# EasyEDA Pro project ProPrj_初级项目_2026-01-11.epro, board PCB1_1
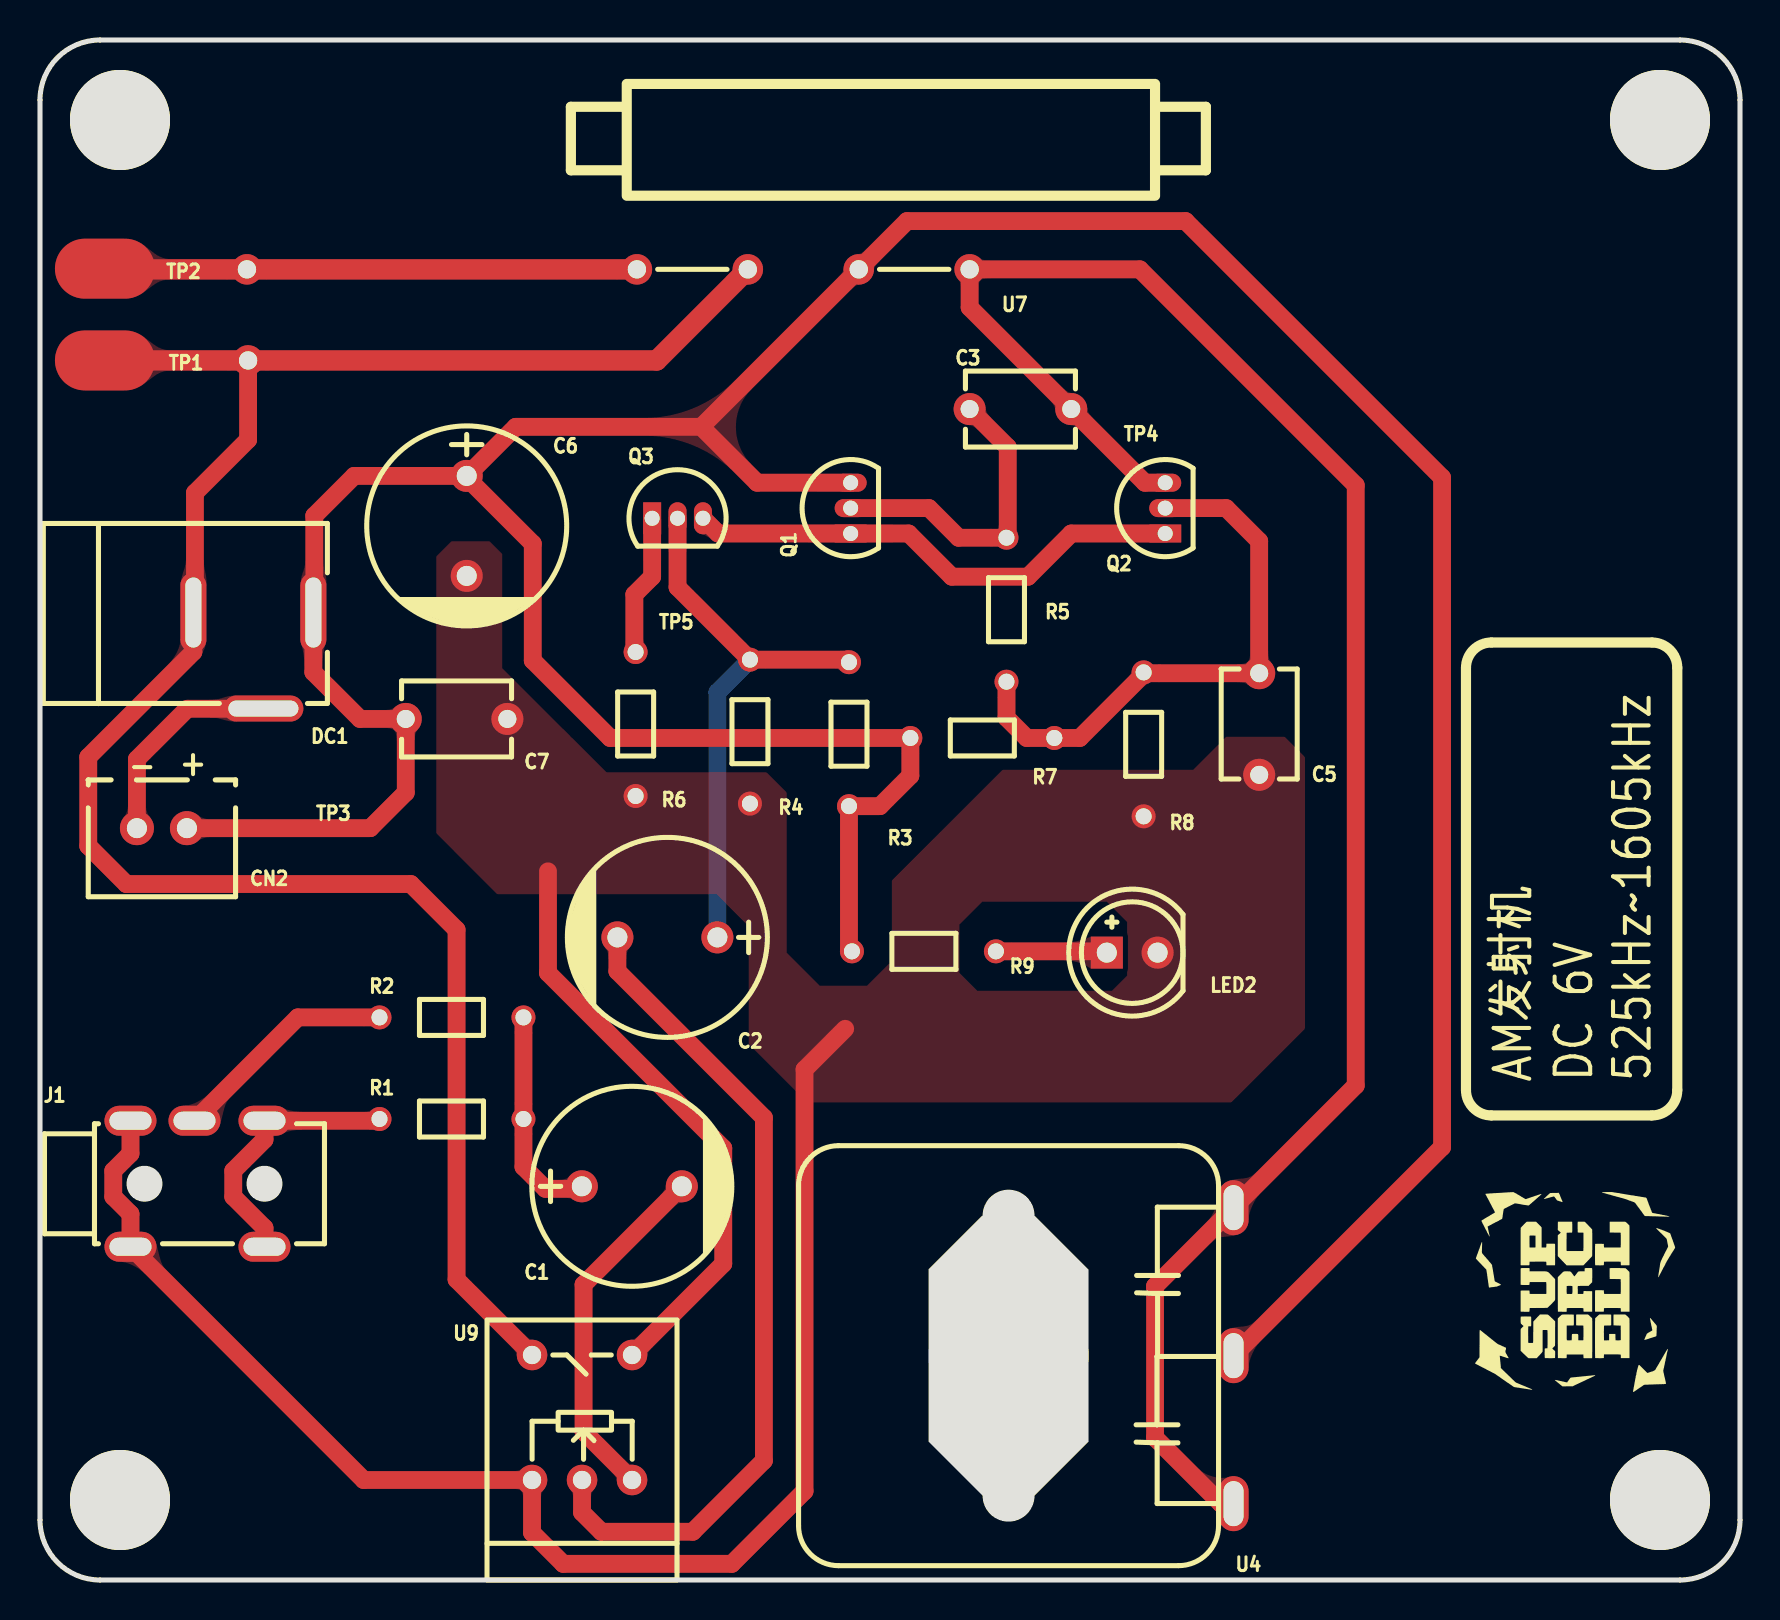
[diagram p4: board, top side]
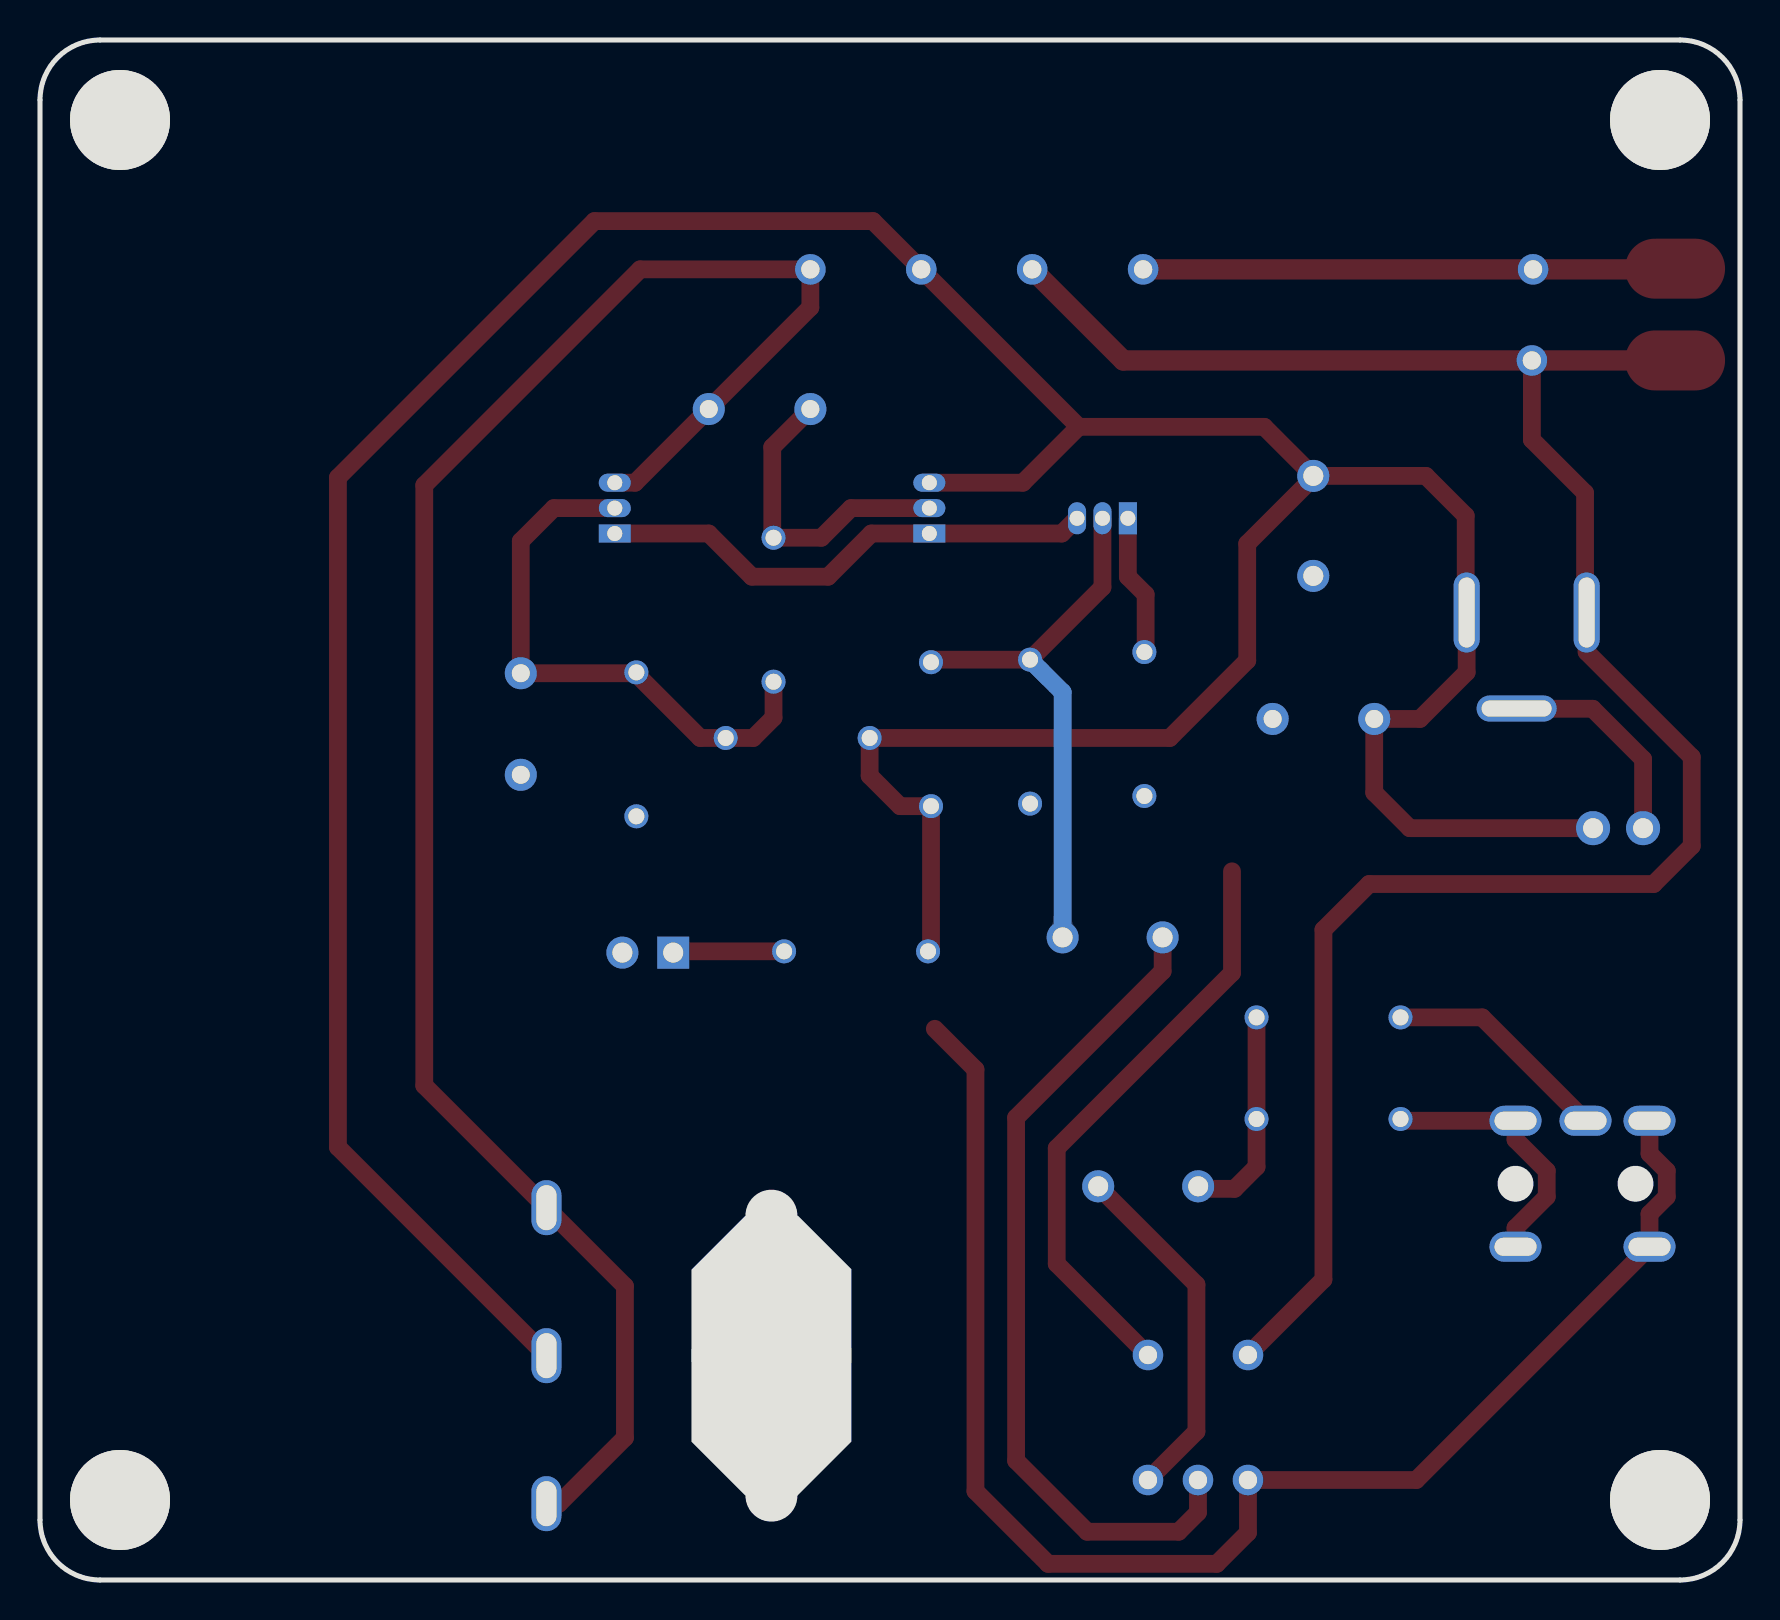
[diagram p5: board, bottom side, seen from below]

Outline 85 x 77 mm; copper layers: Top Layer, Bottom Layer. Coordinates in mm from the lower left corner of the outline.
Outline path: 0,74 0,3 arc(0.88,0.88) 3,0 82,0 arc(84.12,0.88) 85,3 85,74 arc(84.12,76.12) 82,77 3,77 arc(0.88,76.12) 0,74
Stack: Top Layer 0.035mm / Dielectric1 1.51mm FR4 er 4.5 / Bottom Layer 0.035mm

## Design rules (mm)
template: 自定义配置
spacing copperThickness1oz (default): track to track 0.102, other pairs 0 to 0.3
spacing copperThickness2oz: track to track 0.203, other pairs 0.152 to 0.3
track width copperThickness1oz: min 0.127, default 0.254, max 2.54
track width copperThickness2oz (default): min 0.203, default 0.889, max 2.54
differential pair differentialPair (default): width min 0.127, default 0.254, max 2.54; gap min 0.152, default 0.152
via viaSize (default): diameter min 0.5, default 0.61, max 10; hole min 0.3, default 0.305, max 6.299

## Placement (name value [footprint] x y rotation side)
C1  10u  [CAP-TH_BD10.0-P5.00-D0.6-FD]  29.59 19.69 0 top
C2  10u  [CAP-TH_BD10.0-P5.00-D0.6-FD]  31.37 32.13 180 top
C3  100uF  [CAP-TH_L5.5-W3.8-P5.08-D0.5]  49.02 58.55 0 top
C5  0.1uF  [CAP-TH_L5.5-W3.8-P5.08-D0.5]  60.96 42.8 90 top
C6  100u  [CAP-TH_BD10.0-P5.00-D0.6-FD]  21.34 52.7 270 top
C7  0.022uF  [CAP-TH_L5.5-W3.8-P5.08-D0.5]  20.83 43.05 180 top
CN2  B2B-XH-A(LF)(SN)  [CONN-TH_B2B-XH-A-LF-SN]  6.1 37.59 180 top
DC1  -  [DC-2.0]  10.54 48.64 180 top
J1  313耳机座直插  [AUDIO-TH_PJ313D]  7.87 19.81 0 top
LED2  -  [LED-TH_5mm]  54.61 31.37 0 top
NOREF  -  [Pad_e899]  10.41 60.98 0 top
NOREF#2  -  [Pad_e893]  10.35 65.53 0 top
Q1  S9018H331  [TO-92-3_L4.8-W3.7-P1.27-L-1]  40.53 53.59 90 top
Q2  S9018H331  [TO-92-3_L4.8-W3.7-P1.27-L-1]  56.26 53.59 90 top
Q3  S9018H331  [TO-92-3_L4.8-W3.7-P1.27-L-1]  31.88 53.09 0 top
R1  1kΩ  [Res_1/8W]  20.57 22.99 0 top
R2  1kΩ  [Res_1/8W]  20.57 28.07 0 top
R3  51kΩ  [Res_1/8W]  40.39 42.29 270 top
R4  8.2kΩ  [Res_1/8W]  35.56 42.42 90 top
R5  100kΩ  [Res_1/8W]  48.39 48.51 90 top
R6  3.3kΩ  [Res_1/8W]  29.84 42.8 90 top
R7  43kΩ  [Res_1/8W]  47.12 42.16 180 top
R8  15kΩ  [Res_1/8W]  55.25 41.78 90 top
R9  8.2kΩ  [Res_1/8W]  44.2 31.5 180 top
TP1  -  [Test-Point-0.5mm]  3.25 60.98 0 top
TP2  -  [Test-Point-0.5mm]  3.25 65.57 0 top
TP3  -  [Test-Point-0.5mm#2]  13.97 37.55 0 top
TP4  -  [Test-Point-0.5mm#2]  53.57 56.61 0 top
TP5  -  [Test-Point-0.5mm#2]  29.71 48.12 0 top
U4  -  [可变电容]  58.93 21.72 180 top
U7  -  [天线变压器]  51.31 72.9 180 top
U9  -  [发射机点位图]  22.35 0 0 top
U10  -  [固定孔]  4 73 0 top
U11  -  [固定孔]  81 73 0 top
U12  -  [固定孔]  4 4 0 top
U13  -  [固定孔]  81 4 0 top

## Footprints (pads in the part's own frame, mm; a bottom-side part is the same pattern mirrored in y, then rotated)
AUDIO-TH_PJ313D
  oval 2.6x1.5 hole 2.1x0.9: 2(-3.35,3.15) 2(-3.35,-3.15) 3(-0.15,3.15) 4(3.35,3.15) 4(3.35,-3.15)
CAP-TH_BD10.0-P5.00-D0.6-FD
  round 1.6 hole 1: 1(-2.5,0) 2(2.5,0)
CAP-TH_L5.5-W3.8-P5.08-D0.5
  round 1.6 hole 0.9: 1(-2.54,0) 2(2.54,0)
CONN-TH_B2B-XH-A-LF-SN
  round 1.7 hole 1: 1(1.25,0) 2(-1.25,0)
DC-2.0
  oval 4x1.3 hole 3.5x0.8: 2(-0.627,5.067)
  oval 1.3x4 hole 0.8x3.5: 3(2.873,0.267) 4(-3.127,0.267)
LED-TH_5mm
  rect 1.6x1.6 hole 1: 1(-1.27,0)
  round 1.6 hole 1: 2(1.27,0)
Pad_e893
  round 1.524 hole 0.914: 1(0,0)
Pad_e899
  round 1.524 hole 0.914: 2(0,0)
Res_1/8W
  round 1.199 hole 0.8: 1(-3.599,0.063) 2(3.599,0.063)
Test-Point-0.5mm
  oval 5x3 smd: 1(0,0)
Test-Point-0.5mm#2
  round 0.7 smd: 1(0,0)
TO-92-3_L4.8-W3.7-P1.27-L-1
  rect 0.9x1.6 hole 0.75: 1(-1.27,0)
  oval 0.9x1.6 hole 0.75: 2(0,0) 3(1.27,0)
发射机点位图
  round 1.524 hole 0.914: 1(2.25,5) 2(4.75,5) 3(7.25,5) 4(2.25,11.25) 5(7.25,11.25)
可变电容
  oval 1.5x2.75 hole 1x2.25: 1(-0.75,17.9) 2(-0.75,10.5) 3(-0.75,3.1)
固定孔
  round 5 hole 5x3: 1(0,0)
天线变压器
  round 1.524 hole 0.914: 1(4.826,7.366) 2(10.371,7.366) 3(15.918,7.366) 4(21.463,7.366)

## Nets
As in the schematic, except:
NET1: DC1.3 NOREF.2 TP1.1 U7.3 U9.4
$1N961: NOREF#2.1 TP2.1 U7.4

Pads without a net: U10 1; U11 1; U12 1; U13 1

## Routing (per net, layer and track width the routed paths; a pad name or vN(x,y) marks a point on that pad's centre or on a via; arc(x,y) is an arc through that point)
GND: length 104
  Top Layer w0.889: J1.2 4.52,21.32 3.66,20.46 3.66,19.17 4.52,18.31 J1.2 16.19,5 U9.1 24.6,2.37 26.16,0.81 34.59,0.81 38.23,4.44 38.23,25.53 40.26,27.56 ; U9.5 34.16,15.81 34.16,21.59 25.4,30.35 25.4,35.43
NET1: length 104.6
  Top Layer w0.889: U9.4 20.83,15.02 20.83,32.51 18.54,34.8 4.32,34.8 2.41,36.7 2.41,41.15 7.67,46.4 DC1.3 7.75,48.45 7.75,54.36 10.41,57.01 NOREF.2
  Top Layer w1.016: TP1.1 NOREF.2 30.84,60.98 U7.3
$1N941: length 5.6
  Top Layer w0.889: LED2.1 53.28,31.43 R9.1
$1N943: length 15.4
  Top Layer w0.889: C3.1 48.39,56.64 48.39,52.32 ; Q1.2 44.45,53.59 45.93,52.11 R5.2
$1N944: length 28.2
  Top Layer w0.889: 55.23,45.34 R8.2 ; 55.23,45.34 51.99,42.1 R7.1 49.34,42.1 48.32,43.12 48.32,44.92 ; 55.23,45.34 C5.2 60.96,51.94 59.31,53.59 Q2.2
$1N945: length 25.2
  Top Layer w0.889: Q2.1 51.56,52.32 49.4,50.17 45.59,50.17 43.43,52.32 Q1.1 33.91,52.32 Q3.3
$1N946: length 28.1
  Top Layer w0.889: Q3.2 31.88,49.64 35.5,46.02 40.32,46.02 R3.1
  Bottom Layer w0.889: C2.1 33.87,44.39 35.5,46.02
$1N950: length 10.9
  Top Layer w0.889: C1.1 26.96,19.56 25.27,19.56 24.17,20.66 R1.2 R2.2
$1N953: length 11.4
  Top Layer w0.889: R2.1 12.89,28.13 J1.3
$1N954: length 13.4
  Top Layer w0.889: R1.1 16.89,22.96 J1.4 11.22,22.02 9.66,20.46 9.66,19.17 11.22,17.61 J1.4
$1N959: length 7.1
  Top Layer w0.889: R6.2 29.72,46.46 29.72,49.28 30.61,50.17 Q3.1
$1N961: length 27
  Top Layer w1.016: TP2.1 3.08,65.57 3.05,65.53 NOREF#2.1 U7.4
$1N1572: length 41.8
  Top Layer w0.889: U9.2 27.1,3.38 28.07,2.41 32.64,2.41 36.19,5.97 36.19,23.11 28.87,30.44 C2.2
$1N1624: length 17.7
  Top Layer w0.889: C1.2 27.18,14.77 27.18,7.42 U9.3
$1N2623: length 197.4
  Top Layer w0.889: C6.1 21.34,55.12 24.64,51.82 24.64,45.97 28.51,42.1 R7.2 43.52,40.22 41.99,38.69 R3.2 40.45,31.58 R9.2 ; C6.1 23.79,57.66 33.06,57.66 ; C6.1 15.71,55.2 13.72,53.21 13.72,48.42 DC1.4 13.67,45.39 16,43.05 C7.2 18.29,39.37 16.51,37.59 CN2.2 ; 33.06,57.66 U7.2 43.35,67.94 57.28,67.94 70.1,55.12 70.1,21.64 59.68,11.22 ; 33.06,57.66 35.86,54.86 Q1.3
$1N2678: length 96.2
  Top Layer w0.889: Q2.3 55.25,54.86 C3.2 46.48,63.63 U7.1 54.99,65.53 65.79,54.74 65.79,24.72 U4.3 55.75,14.69 55.75,7.11 59.05,3.82 U4.1
$1N2856: length 10.8
  Top Layer w0.889: CN2.1 4.85,41.04 7.37,43.56 11.16,43.56 DC1.2

## Copper pours and planes (outline as drawn; the poured copper is in the pictures)
GND on Top Layer: 20.57,51.94 22.48,51.94 23.11,51.31 23.11,45.59 28.32,40.39 36.32,40.39 37.34,39.37 37.34,31.37 38.99,29.72 41.35,29.72 42.6,30.97 42.6,34.98 48.13,40.51 57.66,40.51 59.31,42.16 62.23,42.16 63.25,41.15 63.25,27.56 59.56,23.88 38.35,23.88 35.43,26.8 35.43,32.68 33.82,34.29 22.86,34.29 19.81,37.34 19.81,51.18

Small or netless copper shapes (teardrops, artwork), in the pictures only: 80 on Top Layer, 2 on Bottom Layer

## Text on the board
Top Silkscreen Layer: - | + | DC 6V | 525kHz~1605kHz | AM发射机
